# Altium schematic sheet [2] Output.SchDoc
size A4
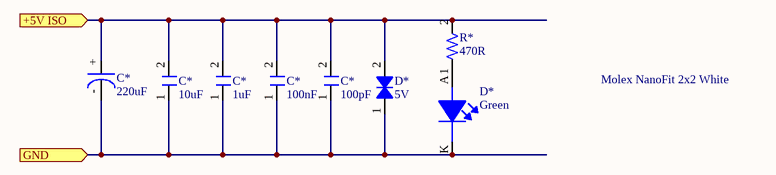
[diagram p0: [2] Output.SchDoc]

## Parts
(Parts that share a designator on the sheet are numbered #1, #2 ... from top to bottom, then left to right.)
C*#1  Capacitance: 220uF  (hidden comment: 860010273009)
C*#2  Capacitance: 10uF  (hidden comment: 885012107014)
C*#3  Capacitance: 1uF  (hidden comment: 885012207103)
C*#4  Capacitance: 100nF  (hidden comment: 885012207098)
C*#5  Capacitance: 100pF  (hidden comment: 885012008004)
D*#1  Reverse Standoff Voltage: 5V  (hidden comment: 824501500)
D*#2  Color: Green  [Resistor_template]  (hidden comment: 150080GS75000)
R*  Resistance: 470R  (hidden comment: CR0805-FX-4700GLF)

## Ports
+5V ISO (in), GND (in)

## Nets
+5V ISO: C*#1.+ C*#2.2 C*#3.2 C*#4.2 C*#5.2 D*#1.2 R*.2 ; port +5V ISO
GND: C*#1.- C*#2.1 C*#3.1 C*#4.1 C*#5.1 D*#1.1 D*#2.K ; port GND
NetD*#2_A: D*#2.A R*.1

## Notes on the sheet
- Molex NanoFit 2x2 White
- Title
- Size:
- Date:
- A4
- Number:
- Time:
- Revision:
- Sheet
- of
- File:

## Library data of the parts
C*#1 = C220u-10V-0.8FPEA: Aluminium Electrolytic Capacitor, Wcap-Atg8 Series, 220 F, 20%, 10 V, 6.3 Mm, Radial Leaded Rohs Compliant: Yes; Manufacturer 1: Wurth Electronics; Voltage Rating: 10V; Polarity: Polar; Ripple Current: 294mA; Life (Hours): 2000Hour; ComponentLink1Description: Datasheet; ComponentLink1URL: https://www.we-online.com/catalog/datasheet/860010273009.pdf; ComponentLink2Description: Where buy it; ComponentLink2URL: https://www.we-online.com/catalog/en/WCAP-ATG8?sq=860010273009&sp=https%3A%2F%2Fwww.we-online.com%2Fweb%2Fen%2Fwuerth_elektronik%2Fsearchpage.php%3Fsearch%3D860010273009#860010273009; Supplier 1: Newark; Manufacturer Part Number 1: 860010273009; RoHS: Yes; Category: Aluminum Electrolytic Capacitors; Stock 1: 95; Pricing 1: 1=0,18600, 10=0,17700, 25=0,16300, 50=0,15000, 100=0,13300, 500=0,10500, 1000=0,10100 (USD); Mount: Through Hole; Case/Package: Radial; Min Operating Temperature: -40°C; Max Operating Temperature: 85°C; Package Quantity: 1500; Packaging: Tape and Reel; Tolerance: 20%; Voltage Rating (DC): 10V; Diameter: 6.3mm; Height: 11mm; Lead Pitch: 0.098inch; Height - Seated (Max): 0.492inch; REACH SVHC: Unknown; RoHS Compliant: Yes; ComponentLink3URL: http://www.farnell.com/datasheets/1879456.pdf?src-supplier=Farnell; ComponentLink3Description: http://www.farnell.com/datasheets/1879456.pdf?src-supplier=Farnell; ComponentLink4URL: http://katalog.we-online.de/pbs/datasheet/860010273009.pdf?src-supplier=Digi-Key; ComponentLink4Description: http://katalog.we-online.de/pbs/datasheet/860010273009.pdf?src-supplier=Digi-Key; ComponentLink5URL: http://www.farnell.com/datasheets/1879456.pdf?src-supplier=Element14; ComponentLink5Description: http://www.farnell.com/datasheets/1879456.pdf?src-supplier=Element14; Supplier Part Number 1: 40Y3328
C*#2 = C10u-16V-0805FNPC-X5R: Multilayer Ceramic Capacitor, Wcap-Csgp Series, 10 F, 20%, X5R, 16 V, 0805 [2012 Metric] Rohs Compliant: Yes; Manufacturer 1: Wurth Electronics; Voltage Rating: 16V; ComponentLink1Description: Datasheet; ComponentLink1URL: https://www.we-online.com/catalog/datasheet/885012107014.pdf; ComponentLink2Description: Where buy it; ComponentLink2URL: https://www.we-online.com/catalog/en/WCAP-CSGP-16VDC#885012107014; Supplier 1: RSComponents; Manufacturer Part Number 1: 885012107014; RoHS: Yes; Category: Ceramic Capacitors; Stock 1: 1650; Pricing 1: 50=0,21000, 250=0,20200, 500=0,19100, 1000=0,17400, 2500=0,14700 (GBP); Mount: Surface Mount; Case/Package: 0805; Case Code (Metric): 2012; Case Code (Imperial): 0805; Min Operating Temperature: -55°C; Max Operating Temperature: 85°C; Packaging: Cut Tape; Dielectric: X5R; Tolerance: 20%; Voltage Rating (DC): 16V; Length: 0.079inch; Width: 0.049inch; Thickness: 0.057inch; REACH SVHC: Unknown; RoHS Compliant: Yes; ComponentLink3URL: http://www.farnell.com/datasheets/1958454.pdf?src-supplier=Farnell; ComponentLink3Description: http://www.farnell.com/datasheets/1958454.pdf?src-supplier=Farnell; ComponentLink4URL: http://www.farnell.com/datasheets/1958454.pdf?src-supplier=Element14; ComponentLink4Description: http://www.farnell.com/datasheets/1958454.pdf?src-supplier=Element14; ComponentLink5URL: https://katalog.we-online.de/pbs/datasheet/885012107014.pdf?src-supplier=Digi-Key; ComponentLink5Description: https://katalog.we-online.de/pbs/datasheet/885012107014.pdf?src-supplier=Digi-Key; ComponentLink6URL: http://www.farnell.com/datasheets/1958454.pdf?src-supplier=Newark; ComponentLink6Description: http://www.farnell.com/datasheets/1958454.pdf?src-supplier=Newark; Supplier Part Number 1: 1813526
C*#3 = C1u-16V-0805FNPC-X7R: Multilayer Ceramic Capacitor, Wcap-Csgp Series, 1 F, 10%, X7R, 50 V, 0805 [2012 Metric] Rohs Compliant: Yes; Manufacturer 1: Wurth Electronics; Voltage Rating: 50V; ComponentLink1Description: Datasheet; ComponentLink1URL: https://www.we-online.com/catalog/datasheet/885012207103.pdf; ComponentLink2Description: Where buy it; ComponentLink2URL: https://www.we-online.com/catalog/en/article/885012207103; Supplier 1: RSComponents; Manufacturer Part Number 1: 885012207103; RoHS: Yes; Category: Ceramic Capacitors; Stock 1: 5450; Pricing 1: 50=0,27200, 250=0,25300, 500=0,22800, 1250=0,20100, 2500=0,17100 (GBP); Mount: Surface Mount; Case/Package: 0805; Case Code (Metric): 2012; Case Code (Imperial): 0805; Min Operating Temperature: -55°C; Max Operating Temperature: 85°C; Packaging: Cut Tape; Dielectric: X7R; Tolerance: 10%; Voltage Rating (DC): 50V; Length: 0.079inch; Width: 0.049inch; Thickness: 0.053inch; REACH SVHC: Unknown; RoHS Compliant: Yes; ComponentLink3URL: http://www.farnell.com/datasheets/1958501.pdf?src-supplier=Farnell; ComponentLink3Description: http://www.farnell.com/datasheets/1958501.pdf?src-supplier=Farnell; ComponentLink4URL: https://katalog.we-online.de/pbs/datasheet/885012107003.pdf?src-supplier=Digi-Key; ComponentLink4Description: https://katalog.we-online.de/pbs/datasheet/885012107003.pdf?src-supplier=Digi-Key; ComponentLink5URL: http://www.farnell.com/datasheets/1958501.pdf?src-supplier=Element14; ComponentLink5Description: http://www.farnell.com/datasheets/1958501.pdf?src-supplier=Element14; ComponentLink6URL: http://www.farnell.com/datasheets/1958501.pdf?src-supplier=Newark; ComponentLink6Description: http://www.farnell.com/datasheets/1958501.pdf?src-supplier=Newark; Supplier Part Number 1: 1813523
C*#4 = C100n-50V-0805FNPC-X7R: Cap, 0.1ΜF, 50V, 10%, X7R, 0805; Manufacturer 1: Wurth Electronics; ComponentLink1Description: Datasheet; ComponentLink1URL: https://www.we-online.com/catalog/datasheet/885012207098.pdf; ComponentLink2Description: Where buy it; ComponentLink2URL: https://katalog.we-online.de/en/pbs/WCAP-CSGP/885012207098; ComponentLink3URL: http://www.farnell.com/datasheets/1958498.pdf?src-supplier=Farnell; ComponentLink3Description: http://www.farnell.com/datasheets/1958498.pdf?src-supplier=Farnell; ComponentLink4URL: https://katalog.we-online.de/pbs/datasheet/885012207098.pdf?src-supplier=Digi-Key; ComponentLink4Description: https://katalog.we-online.de/pbs/datasheet/885012207098.pdf?src-supplier=Digi-Key; ComponentLink5URL: http://www.farnell.com/datasheets/1958498.pdf?src-supplier=Element14; ComponentLink5Description: http://www.farnell.com/datasheets/1958498.pdf?src-supplier=Element14; ComponentLink6URL: http://www.farnell.com/datasheets/1958498.pdf?src-supplier=Newark; ComponentLink6Description: http://www.farnell.com/datasheets/1958498.pdf?src-supplier=Newark; Supplier 1: RSComponents; Manufacturer Part Number 1: 885012207098; RoHS: Yes; Category: Ceramic Capacitors; Stock 1: 14300; Pricing 1: 100=0,09700, 500=0,06800, 2000=0,05800 (GBP); Mount: Surface Mount; Case/Package: 0805; Case Code (Metric): 2012; Case Code (Imperial): 0805; Min Operating Temperature: -55°C; Max Operating Temperature: 125°C; Packaging: Cut Tape; Voltage Rating: 50V; Dielectric: X7R; Tolerance: 10%; Voltage Rating (DC): 50V; Length: 0.079inch; Width: 0.049inch; Thickness: 0.035inch; REACH SVHC: Unknown; RoHS Compliant: Yes; Supplier Part Number 1: 1813493
C*#5 = C100p-10V-1206FNPC-NP0: Cap, 100PF, 10V, 5%, C0G/NP0, 1206; Manufacturer 1: Wurth Electronics; ComponentLink1Description: Datasheet; ComponentLink1URL: https://www.we-online.com/catalog/datasheet/885012008004.pdf; ComponentLink2Description: Where buy it; ComponentLink2URL: https://katalog.we-online.de/en/pbs/WCAP-CSGP/885012008004; ComponentLink3URL: https://katalog.we-online.de/pbs/datasheet/885012008004.pdf?src-supplier=Digi-Key; ComponentLink3Description: https://katalog.we-online.de/pbs/datasheet/885012008004.pdf?src-supplier=Digi-Key; Supplier 1: Newark; RoHS: Yes; Category: Ceramic Capacitors; Stock 1: 6583; Pricing 1: 10=0,09700, 25=0,09400, 50=0,09000, 100=0,08700 (USD); Mount: Surface Mount; Case/Package: 1206; Case Code (Metric): 3216; Case Code (Imperial): 1206; Min Operating Temperature: -55°C; Max Operating Temperature: 125°C; Packaging: Tape and Reel; Voltage Rating: 10V; Tolerance: 5%; Length: 0.126inch; Width: 0.063inch; Thickness: 0.035inch; RoHS Compliant: Yes; Manufacturer Part Number 1: 885012008004; Supplier Part Number 1: 45AC8379
D*#1 = DTVS-BD-5V-DO-214AC: Tvs Diode, 400W, 5V, Bidir, DO-214AC; Manufacturer 1: Wurth Electronics; Number of Bidirectional Channels: 1; Min Breakdown Voltage: 6.7V; Clamping Voltage: 9.2V; Power Line Protection: No; Polarity: Bidirectional; Peak Pulse Current: 43.5A; ComponentLink1Description: Datasheet; ComponentLink1URL: https://www.we-online.com/catalog/datasheet/824501500.pdf; ComponentLink2Description: Where buy it; ComponentLink2URL: https://katalog.we-online.de/en/pbs/WE-TVSP/824501500; Supplier 1: Digi-Key; Manufacturer Part Number 1: 824501500; RoHS: Yes; Category: TVS Diodes; Pricing 1: 1=0,28000, 10=0,26100, 100=0,23400, 500=0,20400 (USD); Mount: Surface Mount; Number of Pins: 2; Min Operating Temperature: -65°C; Max Operating Temperature: 150°C; Packaging: Cut Tape; Peak Pulse Power: 400W; Max Breakdown Voltage: 6.7V; Resistor Type: Zener; REACH SVHC: Unknown; RoHS Compliant: Yes; ComponentLink3URL: http://www.farnell.com/datasheets/2036400.pdf?src-supplier=Farnell; ComponentLink3Description: http://www.farnell.com/datasheets/2036400.pdf?src-supplier=Farnell; ComponentLink4URL: https://katalog.we-online.de/pbs/datasheet/824501500.pdf?src-supplier=Digi-Key; ComponentLink4Description: https://katalog.we-online.de/pbs/datasheet/824501500.pdf?src-supplier=Digi-Key; ComponentLink5URL: http://www.farnell.com/datasheets/2036400.pdf?src-supplier=Newark; ComponentLink5Description: http://www.farnell.com/datasheets/2036400.pdf?src-supplier=Newark; ComponentLink6URL: http://www.farnell.com/datasheets/2036400.pdf?src-supplier=Element14; ComponentLink6Description: http://www.farnell.com/datasheets/2036400.pdf?src-supplier=Element14; Supplier Part Number 1: 732-9939-1-ND
D*#2 = LEDGS-0805-450: Led, Green, 520 Nm, 3.2 V, 30 Ma, 450 Mcd Rohs Compliant: Yes; Manufacturer 1: Wurth Electronics; Viewing Angle: 140°; Lens Style: Clear,Rectangular; Luminous Intensity: 450mcd; Forward Voltage: 3.2V; Wavelength: 520nm; Forward Current: 30mA; Test Current: 20mA; ComponentLink1Description: Datasheet; ComponentLink1URL: https://www.we-online.com/catalog/datasheet/150080GS75000.pdf; ComponentLink2Description: Where buy it; ComponentLink2URL: https://katalog.we-online.de/en/led/WL-SMCW/150080GS75000; Supplier 1: RSComponents; Manufacturer Part Number 1: 150080GS75000; RoHS: Yes; Category: LEDs; Stock 1: 4350; Pricing 1: 50=0,19300, 500=0,12900, 1000=0,12300, 2000=0,11700, 4000=0,11100 (USD); Mount: Surface Mount; Case/Package: 0805; Case Code (Metric): 2012; Case Code (Imperial): 0805; Min Operating Temperature: -40°C; Max Operating Temperature: 85°C; Package Quantity: 4000; Packaging: Cut Tape; Dominant Wavelength: 520nm; Length: 2mm; Width: 1.25mm; Height: 0.7mm; REACH SVHC: Unknown; RoHS Compliant: Yes; ComponentLink3URL: https://datasheet.ciiva.com/29563/150080gs75000-29563008.pdf?src-supplier=Digi-Key; ComponentLink3Description: https://datasheet.ciiva.com/29563/150080gs75000-29563008.pdf?src-supplier=Digi-Key; ComponentLink4URL: https://datasheet.ciiva.com/29279/759434-da-01-en-chipled-0805-w-kl-gruen-150080gs75000-29279039.pdf?src-supplier=Conrad; ComponentLink4Description: https://datasheet.ciiva.com/29279/759434-da-01-en-chipled-0805-w-kl-gruen-150080gs75000-29279039.pdf?src-supplier=Conrad; Supplier Part Number 1: 8154221
R* = R470-0805FTK: Res Thick Film 0805 470 Ohm 1% 1/8W ±100ppm/°C Molded SMD SMD Paper Tape on Plastic Reel; Manufacturer 1: Bourns; Power Rating: 125mW; Voltage Rating: 150V; ComponentLink1Description: Datasheet; ComponentLink2Description: Where buy it; Supplier 1: Arrow Electronics; Manufacturer Part Number 1: CR0805-FX-4700GLF; RoHS: Yes; Category: Chip SMD Resistors; Stock 1: 12623; Pricing 1: 1=0,00990, 10=0,00980, 25=0,00950, 50=0,00940, 100=0,00930, 250=0,00920, 500=0,00910, 1000=0,00890, 3000=0,00870, 6000=0,00860 (USD); Mount: Surface Mount; Case/Package: 0805; Number of Pins: 2; Contact Plating: Tin; Case Code (Imperial): 0805; Case Code (Metric): 2012; Min Operating Temperature: -55°C; Max Operating Temperature: 155°C; Tolerance: 1%; Resistor Type: Thick Film; Temperature Coefficient: 100ppm/°C; Packaging: Tape and Reel; Termination: SMD/SMT; Voltage Rating (DC): 150V; Features: Moisture Resistant; Series: CR0805; Max Power Dissipation: 125mW; Number of Terminations: 2; Resistance Tolerance: 1%; Construction: Rectangular; Technology: THICK FILM; Length: 2mm; Height: 0.5mm; Depth: 1.25mm; Thickness: 508um; Radiation Hardening: No; REACH SVHC: No SVHC; Military Standard: Not; ComponentLink3URL: https://datasheet.ciiva.com/11808/0900766b80fcdb72-11808686.pdf?src-supplier=RSComponents; ComponentLink3Description: https://datasheet.ciiva.com/11808/0900766b80fcdb72-11808686.pdf?src-supplier=RSComponents; ComponentLink4URL: https://datasheet.ciiva.com/7985/1856384-7985880.pdf?src-supplier=Element14; ComponentLink4Description: https://datasheet.ciiva.com/7985/1856384-7985880.pdf?src-supplier=Element14; ComponentLink5URL: https://datasheet.ciiva.com/22693/1902866-22693247.pdf?src-supplier=Element14; ComponentLink5Description: https://datasheet.ciiva.com/22693/1902866-22693247.pdf?src-supplier=Element14; ComponentLink6URL: https://datasheet.ciiva.com/5541/chpreztr-5541930.pdf?src-supplier=Mouser; ComponentLink6Description: https://datasheet.ciiva.com/5541/chpreztr-5541930.pdf?src-supplier=Mouser; Supplier Part Number 1: CR0805-FX-4700GLF